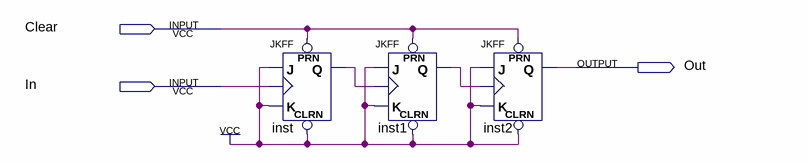
[diagram p0: schematic sheet]
// Quartus schematic RC_4to1.bdf as structural Verilog: 3 symbols, 3 pins
module RC_4to1 (
  input  Clear,
  input  In,
  output Out
);

  wire inst1_q, inst_q;

  JKFF inst (.PRN(Clear), .CLRN(1'b1), .K(1'b1), .J(1'b1), .CLK(In), .Q(inst_q));
  JKFF inst1 (.PRN(Clear), .CLRN(1'b1), .K(1'b1), .J(1'b1), .CLK(inst_q), .Q(inst1_q));
  JKFF inst2 (.PRN(Clear), .CLRN(1'b1), .K(1'b1), .J(1'b1), .CLK(inst1_q), .Q(Out));
endmodule
